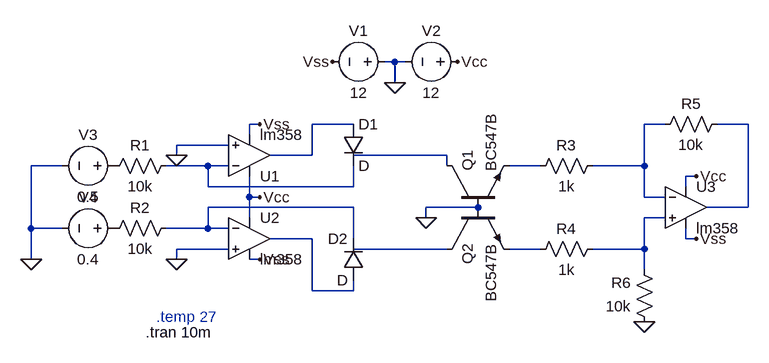
[diagram p0: schematic log_unknown.asc]
log_unknown.asc, the LTspice schematic file:
Version 4
SHEET 1 1320 680
WIRE 400 -16 384 -16
WIRE 416 -16 400 -16
WIRE 400 16 400 -16
WIRE 192 80 176 80
WIRE 336 80 272 80
WIRE 816 80 784 80
WIRE 944 80 896 80
WIRE 176 96 176 80
WIRE 144 112 64 112
WIRE 64 128 64 112
WIRE 272 128 272 80
WIRE 272 128 208 128
WIRE 480 128 336 128
WIRE -112 144 -160 144
WIRE 112 144 48 144
WIRE 144 144 112 144
WIRE 480 144 480 128
WIRE 624 144 576 144
WIRE 784 144 784 80
WIRE 784 144 704 144
WIRE 864 160 848 160
WIRE 112 176 112 144
WIRE 336 176 336 144
WIRE 336 176 112 176
WIRE 848 176 848 160
WIRE 176 192 176 160
WIRE 192 192 176 192
WIRE 784 192 784 144
WIRE 816 192 784 192
WIRE 336 208 112 208
WIRE 528 208 448 208
WIRE 944 208 944 80
WIRE 944 208 880 208
WIRE 176 224 176 192
WIRE 448 224 448 208
WIRE 816 224 784 224
WIRE -160 240 -160 144
WIRE -112 240 -160 240
WIRE 112 240 112 208
WIRE 112 240 48 240
WIRE 144 240 112 240
WIRE 272 256 208 256
WIRE 336 256 336 208
WIRE 848 256 848 240
WIRE 864 256 848 256
WIRE 144 272 64 272
WIRE 480 272 336 272
WIRE 624 272 576 272
WIRE 784 272 784 224
WIRE 784 272 704 272
WIRE -160 288 -160 240
WIRE 64 288 64 272
WIRE 192 288 176 288
WIRE 784 304 784 272
WIRE 272 336 272 256
WIRE 336 336 336 320
WIRE 336 336 272 336
FLAG 64 128 0
FLAG 64 288 0
FLAG 400 16 0
FLAG -160 288 0
FLAG 448 224 0
FLAG 496 -16 Vcc
FLAG 192 192 Vcc
FLAG 864 160 Vcc
FLAG 192 288 Vss
FLAG 192 80 Vss
FLAG 864 256 Vss
FLAG 304 -16 Vss
FLAG 784 384 0
SYMBOL voltage 400 -16 R90
WINDOW 0 -32 56 VBottom 2
WINDOW 3 32 56 VTop 2
WINDOW 123 0 0 Left 0
WINDOW 39 0 0 Left 0
SYMATTR InstName V1
SYMATTR Value 12
SYMBOL voltage 512 -16 R90
WINDOW 0 -32 56 VBottom 2
WINDOW 3 32 56 VTop 2
WINDOW 123 0 0 Left 0
WINDOW 39 0 0 Left 0
SYMATTR InstName V2
SYMATTR Value 12
SYMBOL res 64 224 R90
WINDOW 0 0 56 VBottom 2
WINDOW 3 32 56 VTop 2
SYMATTR InstName R2
SYMATTR Value 10k
SYMBOL res 64 128 R90
WINDOW 0 0 56 VBottom 2
WINDOW 3 32 56 VTop 2
SYMATTR InstName R1
SYMATTR Value 10k
SYMBOL npn 480 208 R270
SYMATTR InstName Q1
SYMATTR Value BC547B
SYMBOL OpAmps\\lm358 176 192 M180
SYMATTR InstName U1
SYMBOL OpAmps\\lm358 176 192 R0
SYMATTR InstName U2
SYMBOL voltage -16 144 R90
WINDOW 0 -32 56 VBottom 2
WINDOW 3 32 56 VTop 2
WINDOW 123 0 0 Left 0
WINDOW 39 0 0 Left 0
SYMATTR InstName V3
SYMATTR Value 0.5
SYMBOL voltage -16 240 R90
WINDOW 0 -32 56 VBottom 2
WINDOW 3 32 56 VTop 2
WINDOW 123 0 0 Left 0
WINDOW 39 0 0 Left 0
SYMATTR InstName V4
SYMATTR Value 0.4
SYMBOL diode 320 80 R0
SYMATTR InstName D1
SYMBOL diode 352 320 R180
WINDOW 0 24 64 Left 2
WINDOW 3 24 0 Left 2
SYMATTR InstName D2
SYMBOL npn 480 208 M90
SYMATTR InstName Q2
SYMATTR Value BC547B
SYMBOL res 720 128 R90
WINDOW 0 0 56 VBottom 2
WINDOW 3 32 56 VTop 2
SYMATTR InstName R3
SYMATTR Value 1k
SYMBOL res 720 256 R90
WINDOW 0 0 56 VBottom 2
WINDOW 3 32 56 VTop 2
SYMATTR InstName R4
SYMATTR Value 1k
SYMBOL OpAmps\\lm358 848 144 R0
SYMATTR InstName U3
SYMBOL res 912 64 R90
WINDOW 0 0 56 VBottom 2
WINDOW 3 32 56 VTop 2
SYMATTR InstName R5
SYMATTR Value 10k
SYMBOL res 800 400 R180
WINDOW 0 36 76 Left 2
WINDOW 3 36 40 Left 2
SYMATTR InstName R6
SYMATTR Value 10k
TEXT 16 400 Left 2 !.tran 10m
TEXT 32 376 Left 2 ;.temp 27

The netlist it stands for:
* log_unknown.asc
V1 0 Vss 12
V2 Vcc 0 12
R2 N007 P001 10k
R1 N005 P002 10k
Q1 N004 0 N006 0 BC547B
XU1 0 N005 Vcc Vss N001 lm358  ; pins In+ In- V+ V- OUT
XU2 0 N007 Vcc Vss N009 lm358  ; pins In+ In- V+ V- OUT
V3 P002 0 0.5
V4 P001 0 0.4
D1 N001 N005 D
D2 N009 N007 D
Q2 N010 0 N011 0 BC547B
R3 N002 N006 1k
R4 N008 N011 1k
XU3 N008 N002 Vcc Vss N003 lm358  ; pins In+ In- V+ V- OUT
R5 N003 N002 10k
R6 0 N008 10k
.model D D
.lib standard.dio
.model NPN NPN
.model PNP PNP
.lib standard.bjt
.tran 10m
* .temp 27
.backanno
.end